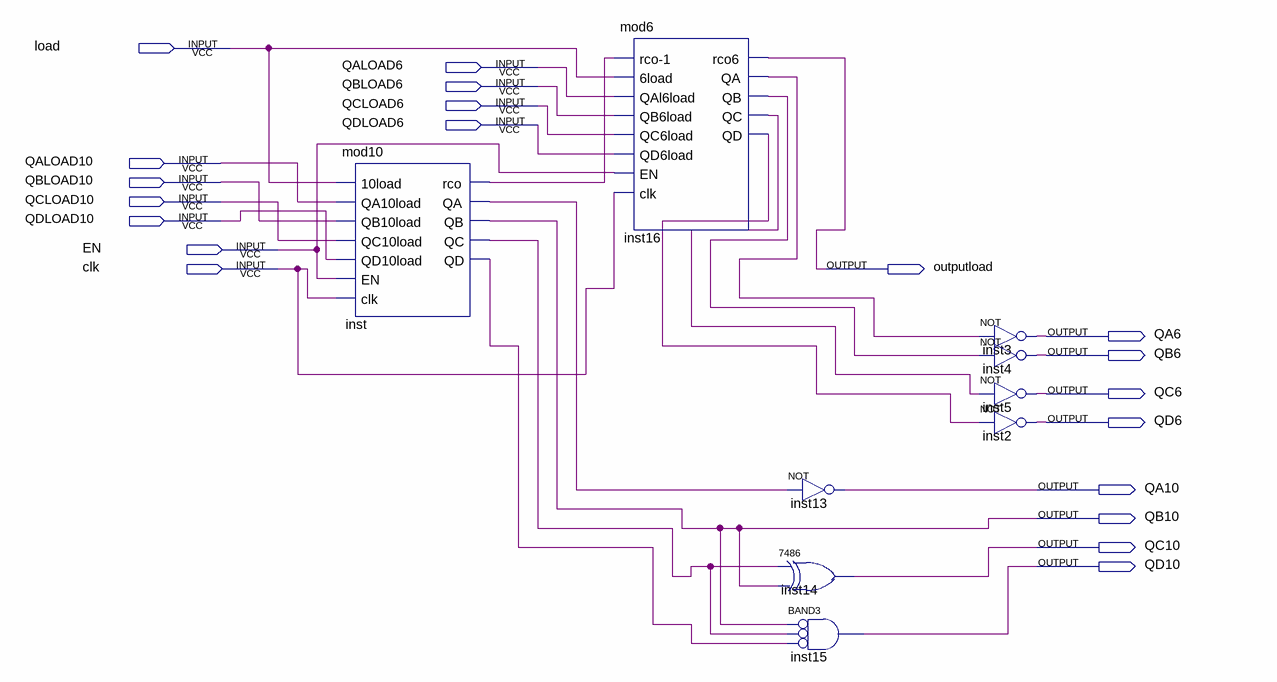
[diagram p0: schematic sheet]
// Quartus schematic mod60.bdf as structural Verilog: 9 symbols, 20 pins
module mod60 (
  input  load,
  input  QALOAD6,
  input  QBLOAD6,
  input  QCLOAD6,
  input  QDLOAD6,
  input  QALOAD10,
  input  QBLOAD10,
  input  QCLOAD10,
  input  QDLOAD10,
  input  EN,
  input  clk,
  output outputload,
  output QA6,
  output QB6,
  output QC6,
  output QD6,
  output QA10,
  output QB10,
  output QC10,
  output QD10
);

  wire inst16_qa, inst16_qb, inst16_qc, inst16_qd, inst_qa, inst_qc, inst_qd, inst_rco;

  mod10 inst (
    .\10load (load), .QA10load(QALOAD10), .QB10load(QBLOAD10), .QC10load(QCLOAD10), .QD10load(QDLOAD10),
    .EN(EN), .clk(clk), .rco(inst_rco), .QA(inst_qa), .QB(QB10), .QC(inst_qc), .QD(inst_qd));
  mod6 inst16 (
    .\rco-1 (inst_rco), .\6load (load), .QAl6load(QALOAD6), .QB6load(QBLOAD6), .QC6load(QCLOAD6),
    .QD6load(QDLOAD6), .EN(EN), .clk(clk), .rco6(outputload), .QA(inst16_qa), .QB(inst16_qb), .QC(inst16_qc),
    .QD(inst16_qd));
  \7486  inst14 (.\2 (inst_qc), .\3 (QB10), .\1 (QC10));
  not inst13 (QA10, inst_qa);
  and inst15 (QD10, ~QB10, ~inst_qc, ~inst_qd);  // BAND3
  not inst3 (QA6, inst16_qa);
  not inst4 (QB6, inst16_qb);
  not inst5 (QC6, inst16_qc);
  not inst2 (QD6, inst16_qd);
endmodule
